# Altium schematic sheet napajalnik3.3.SchDoc
size A; SheetNumber: 2; SheetTotal: 8
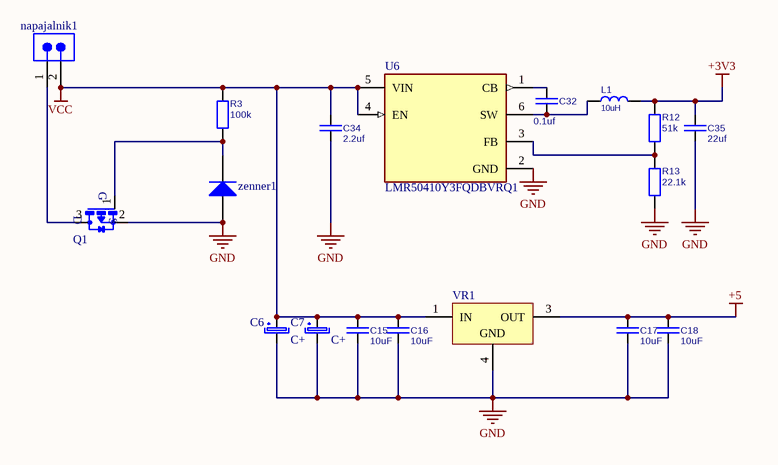
[diagram p0: napajalnik3.3.SchDoc]

## Parts
C6  C+  [C AlElko R2.54 FI5]
C7  C+  [C AlElko R2.54 FI5]
C15  10uF  [C0603]
C16  10uF  [C0603]
C17  10uF  [C0603]
C18  10uF  [C0603]
C32  0.1uf  [C0603]
C34  2.2uf  [C0603]
C35  22uf  [C0603]
L1  10uH  [R400]
napajalnik1  napajalnik  [691321100002]  (value not drawn)
Q1  SI2323DS-T1-GE3  [SOT23]  (value not drawn)
R3  value 100k  [R0603]  (hidden comment: R1)
R12  51k  [R0805]
R13  22.1k  [R0805]
U6  LMR50410Y3FQDBVRQ1  [FP-DBV0006A-IPC_C]
VR1  L7805ACD2T-TR  [TO-263_N]  (value not drawn)
zenner1  MMSZ5248B  [FAIR-SOD-123-2_V]  (value not drawn)

## Nets
+3V3: C35.1 L1.2 R12.1
+5: C17.1 C18.1 VR1.3(OUT)
GND: C6.2 C7.2 C15.2 C16.2 C17.2 C18.2 C34.2 C35.2 Q1.2(S) R13.2 U6.2(GND) VR1.4(GND) zenner1.1(A)
VCC: C6.1 C7.1 C15.1 C16.1 C34.1 napajalnik1.2 R3.1 U6.4(EN) U6.5(VIN) VR1.1(IN)
NetC32_1: C32.1 U6.1(CB)
NetC32_2: C32.2 L1.1 U6.6(SW)
Netnapajalnik1_1: napajalnik1.1 Q1.3(D)
NetQ1_1: Q1.1(G) R3.2 zenner1.2(K)
NetR12_2: R12.2 R13.1 U6.3(FB)

## Library data of the parts
C6 C7 = C+: Capacitor Polarized
C15-C18 C32 C34 C35 = C: Capacitor
  C15-C18: Value: 10uF
  C32: Value: 0.1uf
  C34: Value: 2.2uf
  C35: Value: 22uf
L1 = L: Value: 10uH
napajalnik1 = CMP-1502-01783-2: NexarPartId: 18818340; Current Rating: 10A; Voltage: 300V; Pitch: 3.5052mm; Number of Contacts: 2; Number of Levels: 1; Gender: Male; Termination: Solder; Lead Free: Lead Free; Number of Rows: 1; Contact Material: Brass; Width: 8.1mm; Length: 7mm; Voltage Rating: 300V; Min Operating Temperature: -40°C; Number of Pins: 2; Height: 7.2mm; Mount: Through Hole; Max Operating Temperature: 105°C; RoHS: Compliant; Orientation: Vertical; Number of Positions Per Level: 2; Current: 10A; REACH SVHC: Unknown; Color: Green; Lead Pitch: 3.5mm; Packaging: Box
Q1 = SI2323DS-T1-GE3: P-Channel 20V 3.7A (Ta) 750mW (Ta) Surface Mount SOT-23-3 (TO-236); MF: Vishay; Package: SOT-23-3 Vishay; Price: None; Value: *; SnapEDA_Link: https://www.snapeda.com/parts/SI2323DS-T1-GE3/Vishay%20Siliconix/view-part/1098074/?ref=snap; MP: SI2323DS-T1-GE3; Availability: Unavailable
R3 R12 R13 = R
  R12: Value: 51k
  R13: Value: 22.1k
U6 = CMP-04918-000634-1: AUTOMOTIVE QUALIFIED SIMPLE SWIT
VR1 = CMP-0244-00214-1: Positive Voltage Regulator, 3-Pin D2PAK, Tape and Reel; DatasheetVersion: 16/11/2011; PackageVersion: 2011; PackageReference: TO-263; PackageDescription: 3-Pin Transistor Outline Package 2.54 mm Pitch, 15.4 mm Lead Span (D2PAK); ComponentLink2URL: http://www.st.com/internet/com/TECHNICAL_RESOURCES/TECHNICAL_LITERATURE/DATASHEET/CD00000444.pdf; ComponentLink1URL: http://www.st.com; ComponentLink1Description: Manufacturer URL; ComponentLink2Description: Datasheet
zenner1 = CMP-2000-06744-1: Zener Diode, 18 V, -55 to 150 degC, 2-Pin SOD-123, RoHS, Tape and Reel; Manufacturer: FairchildSemiconductor; Manuf. Code: FSC; Residual reverse leakage current: 0.1µA; Max. power: 500mW; Enclosure: SOD123; Impedance reference: 7mA; Configuration: 1diode; Uz(min.): 17.1V; Forward voltage reference: 10mA; UF: 900mV; Zener voltage: 18V; Uz (max.): 18.9V; Impedance: 21Ω; Category: Zenerdiode; Package Description: 2-Pin Surface Mount Device, Body 2.7 x 1.6 mm; Type: MMSZ5248B; Manufacturer URL: https://www.fairchildsemi.com/; Operating temperature (min.): -55°C; Datasheet URL: https://www.fairchildsemi.com/datasheets/MM/MMSZ5226B.pdf; Mounting type: Surface-mount; Max. operating temperature: +150°C; Mounting Technology: SurfaceMount; Datasheet Version: Rev. 1.6, 10/2015; Package Reference: SOD-123-2